# Altium schematic sheet leds.SchDoc
size A3
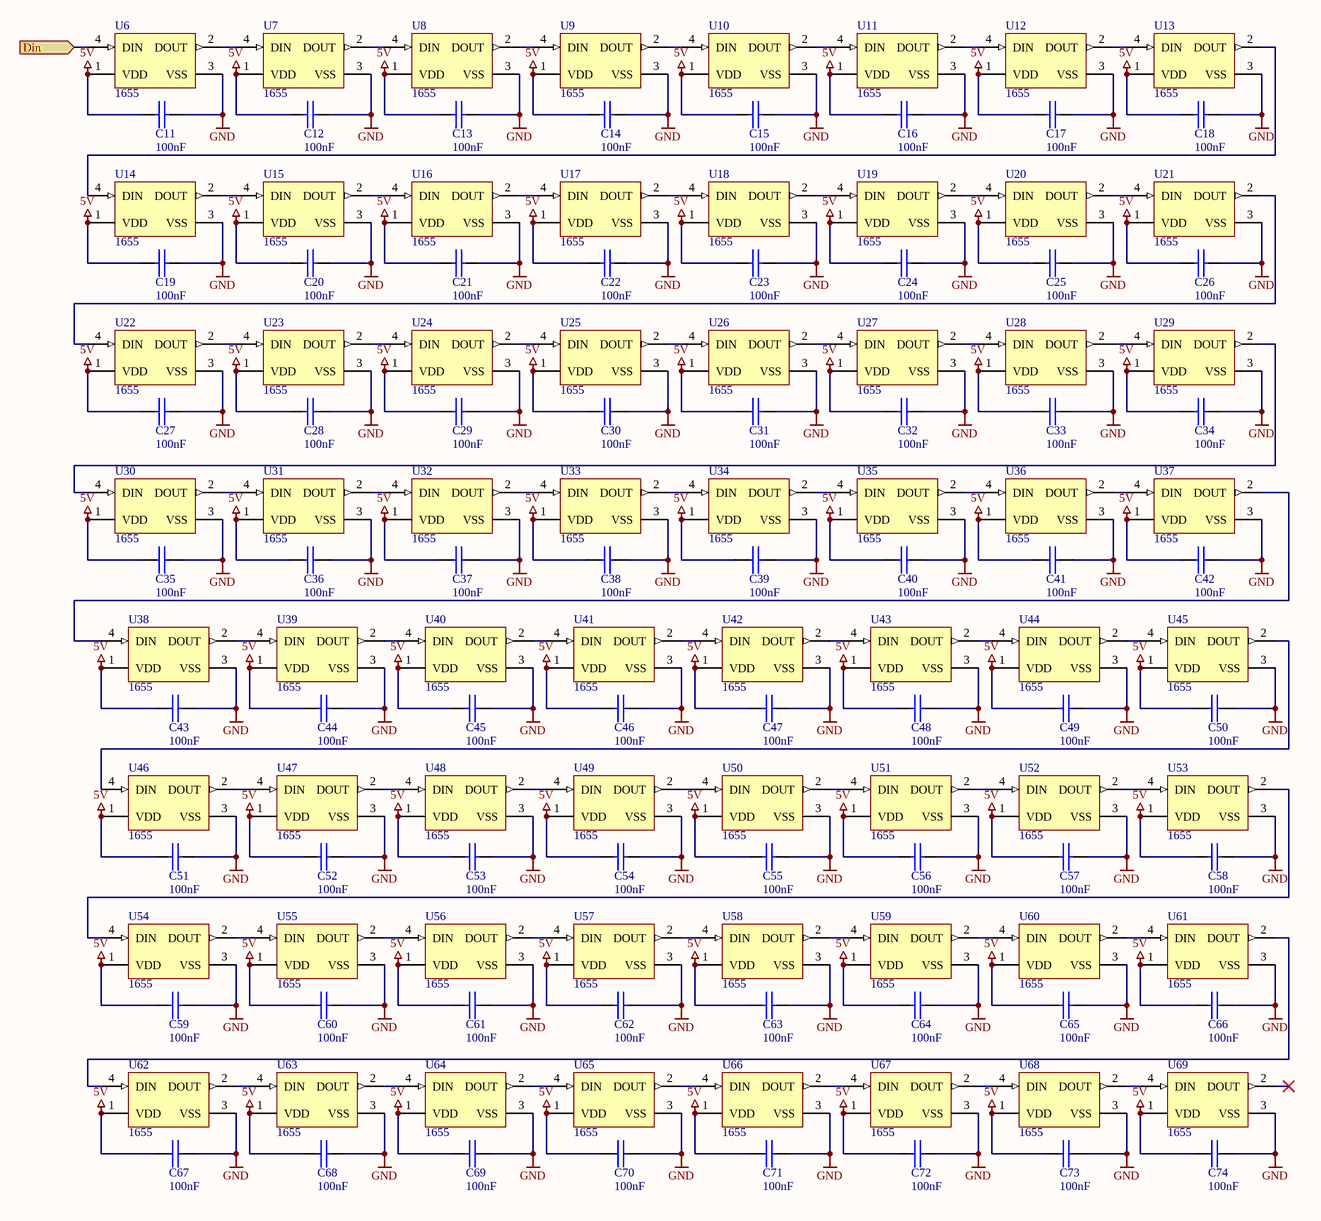
[diagram p0: leds.SchDoc]

## Parts
C11  100nF  [Cap_0805]
C12  100nF  [Cap_0805]
C13  100nF  [Cap_0805]
C14  100nF  [Cap_0805]
C15  100nF  [Cap_0805]
C16  100nF  [Cap_0805]
C17  100nF  [Cap_0805]
C18  100nF  [Cap_0805]
C19  100nF  [Cap_0805]
C20  100nF  [Cap_0805]
C21  100nF  [Cap_0805]
C22  100nF  [Cap_0805]
C23  100nF  [Cap_0805]
C24  100nF  [Cap_0805]
C25  100nF  [Cap_0805]
C26  100nF  [Cap_0805]
C27  100nF  [Cap_0805]
C28  100nF  [Cap_0805]
C29  100nF  [Cap_0805]
C30  100nF  [Cap_0805]
C31  100nF  [Cap_0805]
C32  100nF  [Cap_0805]
C33  100nF  [Cap_0805]
C34  100nF  [Cap_0805]
C35  100nF  [Cap_0805]
C36  100nF  [Cap_0805]
C37  100nF  [Cap_0805]
C38  100nF  [Cap_0805]
C39  100nF  [Cap_0805]
C40  100nF  [Cap_0805]
C41  100nF  [Cap_0805]
C42  100nF  [Cap_0805]
C43  100nF  [Cap_0805]
C44  100nF  [Cap_0805]
C45  100nF  [Cap_0805]
C46  100nF  [Cap_0805]
C47  100nF  [Cap_0805]
C48  100nF  [Cap_0805]
C49  100nF  [Cap_0805]
C50  100nF  [Cap_0805]
C51  100nF  [Cap_0805]
C52  100nF  [Cap_0805]
C53  100nF  [Cap_0805]
C54  100nF  [Cap_0805]
C55  100nF  [Cap_0805]
C56  100nF  [Cap_0805]
C57  100nF  [Cap_0805]
C58  100nF  [Cap_0805]
C59  100nF  [Cap_0805]
C60  100nF  [Cap_0805]
C61  100nF  [Cap_0805]
C62  100nF  [Cap_0805]
C63  100nF  [Cap_0805]
C64  100nF  [Cap_0805]
C65  100nF  [Cap_0805]
C66  100nF  [Cap_0805]
C67  100nF  [Cap_0805]
C68  100nF  [Cap_0805]
C69  100nF  [Cap_0805]
C70  100nF  [Cap_0805]
C71  100nF  [Cap_0805]
C72  100nF  [Cap_0805]
C73  100nF  [Cap_0805]
C74  100nF  [Cap_0805]
U6  1655  [ADA-RGB-1655_V]
U7  1655  [ADA-RGB-1655_V]
U8  1655  [ADA-RGB-1655_V]
U9  1655  [ADA-RGB-1655_V]
U10  1655  [ADA-RGB-1655_V]
U11  1655  [ADA-RGB-1655_V]
U12  1655  [ADA-RGB-1655_V]
U13  1655  [ADA-RGB-1655_V]
U14  1655  [ADA-RGB-1655_V]
U15  1655  [ADA-RGB-1655_V]
U16  1655  [ADA-RGB-1655_V]
U17  1655  [ADA-RGB-1655_V]
U18  1655  [ADA-RGB-1655_V]
U19  1655  [ADA-RGB-1655_V]
U20  1655  [ADA-RGB-1655_V]
U21  1655  [ADA-RGB-1655_V]
U22  1655  [ADA-RGB-1655_V]
U23  1655  [ADA-RGB-1655_V]
U24  1655  [ADA-RGB-1655_V]
U25  1655  [ADA-RGB-1655_V]
U26  1655  [ADA-RGB-1655_V]
U27  1655  [ADA-RGB-1655_V]
U28  1655  [ADA-RGB-1655_V]
U29  1655  [ADA-RGB-1655_V]
U30  1655  [ADA-RGB-1655_V]
U31  1655  [ADA-RGB-1655_V]
U32  1655  [ADA-RGB-1655_V]
U33  1655  [ADA-RGB-1655_V]
U34  1655  [ADA-RGB-1655_V]
U35  1655  [ADA-RGB-1655_V]
U36  1655  [ADA-RGB-1655_V]
U37  1655  [ADA-RGB-1655_V]
U38  1655  [ADA-RGB-1655_V]
U39  1655  [ADA-RGB-1655_V]
U40  1655  [ADA-RGB-1655_V]
U41  1655  [ADA-RGB-1655_V]
U42  1655  [ADA-RGB-1655_V]
U43  1655  [ADA-RGB-1655_V]
U44  1655  [ADA-RGB-1655_V]
U45  1655  [ADA-RGB-1655_V]
U46  1655  [ADA-RGB-1655_V]
U47  1655  [ADA-RGB-1655_V]
U48  1655  [ADA-RGB-1655_V]
U49  1655  [ADA-RGB-1655_V]
U50  1655  [ADA-RGB-1655_V]
U51  1655  [ADA-RGB-1655_V]
U52  1655  [ADA-RGB-1655_V]
U53  1655  [ADA-RGB-1655_V]
U54  1655  [ADA-RGB-1655_V]
U55  1655  [ADA-RGB-1655_V]
U56  1655  [ADA-RGB-1655_V]
U57  1655  [ADA-RGB-1655_V]
U58  1655  [ADA-RGB-1655_V]
U59  1655  [ADA-RGB-1655_V]
U60  1655  [ADA-RGB-1655_V]
U61  1655  [ADA-RGB-1655_V]
U62  1655  [ADA-RGB-1655_V]
U63  1655  [ADA-RGB-1655_V]
U64  1655  [ADA-RGB-1655_V]
U65  1655  [ADA-RGB-1655_V]
U66  1655  [ADA-RGB-1655_V]
U67  1655  [ADA-RGB-1655_V]
U68  1655  [ADA-RGB-1655_V]
U69  1655  [ADA-RGB-1655_V]

## Ports
Din (in)

## Nets
5V: C11.1 C12.1 C13.1 C14.1 C15.1 C16.1 C17.1 C18.1 C19.1 C20.1 C21.1 C22.1 C23.1 C24.1 C25.1 C26.1 C27.1 C28.1 C29.1 C30.1 C31.1 C32.1 C33.1 C34.1 C35.1 C36.1 C37.1 C38.1 C39.1 C40.1 C41.1 C42.1 C43.1 C44.1 C45.1 C46.1 C47.1 C48.1 C49.1 C50.1 C51.1 C52.1 C53.1 C54.1 C55.1 C56.1 C57.1 C58.1 C59.1 C60.1 C61.1 C62.1 C63.1 C64.1 C65.1 C66.1 C67.1 C68.1 C69.1 C70.1 C71.1 C72.1 C73.1 C74.1 U6.1(VDD) U7.1(VDD) U8.1(VDD) U9.1(VDD) U10.1(VDD) U11.1(VDD) U12.1(VDD) U13.1(VDD) U14.1(VDD) U15.1(VDD) U16.1(VDD) U17.1(VDD) U18.1(VDD) U19.1(VDD) U20.1(VDD) U21.1(VDD) U22.1(VDD) U23.1(VDD) U24.1(VDD) U25.1(VDD) U26.1(VDD) U27.1(VDD) U28.1(VDD) U29.1(VDD) U30.1(VDD) U31.1(VDD) U32.1(VDD) U33.1(VDD) U34.1(VDD) U35.1(VDD) U36.1(VDD) U37.1(VDD) U38.1(VDD) U39.1(VDD) U40.1(VDD) U41.1(VDD) U42.1(VDD) U43.1(VDD) U44.1(VDD) U45.1(VDD) U46.1(VDD) U47.1(VDD) U48.1(VDD) U49.1(VDD) U50.1(VDD) U51.1(VDD) U52.1(VDD) U53.1(VDD) U54.1(VDD) U55.1(VDD) U56.1(VDD) U57.1(VDD) U58.1(VDD) U59.1(VDD) U60.1(VDD) U61.1(VDD) U62.1(VDD) U63.1(VDD) U64.1(VDD) U65.1(VDD) U66.1(VDD) U67.1(VDD) U68.1(VDD) U69.1(VDD)
GND: C11.2 C12.2 C13.2 C14.2 C15.2 C16.2 C17.2 C18.2 C19.2 C20.2 C21.2 C22.2 C23.2 C24.2 C25.2 C26.2 C27.2 C28.2 C29.2 C30.2 C31.2 C32.2 C33.2 C34.2 C35.2 C36.2 C37.2 C38.2 C39.2 C40.2 C41.2 C42.2 C43.2 C44.2 C45.2 C46.2 C47.2 C48.2 C49.2 C50.2 C51.2 C52.2 C53.2 C54.2 C55.2 C56.2 C57.2 C58.2 C59.2 C60.2 C61.2 C62.2 C63.2 C64.2 C65.2 C66.2 C67.2 C68.2 C69.2 C70.2 C71.2 C72.2 C73.2 C74.2 U6.3(VSS) U7.3(VSS) U8.3(VSS) U9.3(VSS) U10.3(VSS) U11.3(VSS) U12.3(VSS) U13.3(VSS) U14.3(VSS) U15.3(VSS) U16.3(VSS) U17.3(VSS) U18.3(VSS) U19.3(VSS) U20.3(VSS) U21.3(VSS) U22.3(VSS) U23.3(VSS) U24.3(VSS) U25.3(VSS) U26.3(VSS) U27.3(VSS) U28.3(VSS) U29.3(VSS) U30.3(VSS) U31.3(VSS) U32.3(VSS) U33.3(VSS) U34.3(VSS) U35.3(VSS) U36.3(VSS) U37.3(VSS) U38.3(VSS) U39.3(VSS) U40.3(VSS) U41.3(VSS) U42.3(VSS) U43.3(VSS) U44.3(VSS) U45.3(VSS) U46.3(VSS) U47.3(VSS) U48.3(VSS) U49.3(VSS) U50.3(VSS) U51.3(VSS) U52.3(VSS) U53.3(VSS) U54.3(VSS) U55.3(VSS) U56.3(VSS) U57.3(VSS) U58.3(VSS) U59.3(VSS) U60.3(VSS) U61.3(VSS) U62.3(VSS) U63.3(VSS) U64.3(VSS) U65.3(VSS) U66.3(VSS) U67.3(VSS) U68.3(VSS) U69.3(VSS)
Din: U6.4(DIN) ; port Din
NetU6_2: U6.2(DOUT) U7.4(DIN)
NetU7_2: U7.2(DOUT) U8.4(DIN)
NetU8_2: U8.2(DOUT) U9.4(DIN)
NetU9_2: U9.2(DOUT) U10.4(DIN)
NetU10_2: U10.2(DOUT) U11.4(DIN)
NetU11_2: U11.2(DOUT) U12.4(DIN)
NetU12_2: U12.2(DOUT) U13.4(DIN)
NetU13_2: U13.2(DOUT) U14.4(DIN)
NetU14_2: U14.2(DOUT) U15.4(DIN)
NetU15_2: U15.2(DOUT) U16.4(DIN)
NetU16_2: U16.2(DOUT) U17.4(DIN)
NetU17_2: U17.2(DOUT) U18.4(DIN)
NetU18_2: U18.2(DOUT) U19.4(DIN)
NetU19_2: U19.2(DOUT) U20.4(DIN)
NetU20_2: U20.2(DOUT) U21.4(DIN)
NetU21_2: U21.2(DOUT) U22.4(DIN)
NetU22_2: U22.2(DOUT) U23.4(DIN)
NetU23_2: U23.2(DOUT) U24.4(DIN)
NetU24_2: U24.2(DOUT) U25.4(DIN)
NetU25_2: U25.2(DOUT) U26.4(DIN)
NetU26_2: U26.2(DOUT) U27.4(DIN)
NetU27_2: U27.2(DOUT) U28.4(DIN)
NetU28_2: U28.2(DOUT) U29.4(DIN)
NetU29_2: U29.2(DOUT) U30.4(DIN)
NetU30_2: U30.2(DOUT) U31.4(DIN)
NetU31_2: U31.2(DOUT) U32.4(DIN)
NetU32_2: U32.2(DOUT) U33.4(DIN)
NetU33_2: U33.2(DOUT) U34.4(DIN)
NetU34_2: U34.2(DOUT) U35.4(DIN)
NetU35_2: U35.2(DOUT) U36.4(DIN)
NetU36_2: U36.2(DOUT) U37.4(DIN)
NetU37_2: U37.2(DOUT) U38.4(DIN)
NetU38_2: U38.2(DOUT) U39.4(DIN)
NetU39_2: U39.2(DOUT) U40.4(DIN)
NetU40_2: U40.2(DOUT) U41.4(DIN)
NetU41_2: U41.2(DOUT) U42.4(DIN)
NetU42_2: U42.2(DOUT) U43.4(DIN)
NetU43_2: U43.2(DOUT) U44.4(DIN)
NetU44_2: U44.2(DOUT) U45.4(DIN)
NetU45_2: U45.2(DOUT) U46.4(DIN)
NetU46_2: U46.2(DOUT) U47.4(DIN)
NetU47_2: U47.2(DOUT) U48.4(DIN)
NetU48_2: U48.2(DOUT) U49.4(DIN)
NetU49_2: U49.2(DOUT) U50.4(DIN)
NetU50_2: U50.2(DOUT) U51.4(DIN)
NetU51_2: U51.2(DOUT) U52.4(DIN)
NetU52_2: U52.2(DOUT) U53.4(DIN)
NetU53_2: U53.2(DOUT) U54.4(DIN)
NetU54_2: U54.2(DOUT) U55.4(DIN)
NetU55_2: U55.2(DOUT) U56.4(DIN)
NetU56_2: U56.2(DOUT) U57.4(DIN)
NetU57_2: U57.2(DOUT) U58.4(DIN)
NetU58_2: U58.2(DOUT) U59.4(DIN)
NetU59_2: U59.2(DOUT) U60.4(DIN)
NetU60_2: U60.2(DOUT) U61.4(DIN)
NetU61_2: U61.2(DOUT) U62.4(DIN)
NetU62_2: U62.2(DOUT) U63.4(DIN)
NetU63_2: U63.2(DOUT) U64.4(DIN)
NetU64_2: U64.2(DOUT) U65.4(DIN)
NetU65_2: U65.2(DOUT) U66.4(DIN)
NetU66_2: U66.2(DOUT) U67.4(DIN)
NetU67_2: U67.2(DOUT) U68.4(DIN)
NetU68_2: U68.2(DOUT) U69.4(DIN)

Not connected (* = marked no-connect by the designer): U69 2(DOUT)*

## Library data of the parts
C11-C74 = C: SDTSourceLibName: C:\WINDOWS\TEMP\DA.LIB; PCB Footprint: RC0805
U6-U69 = CMP-2000-05026-1: Intelligent Control LED Integrated Light Source, 3.5 to 5.3 V, -25 to 80 degC, 4-Pin SMD, RoHS, Tape and Reel; Manufacturer: Adafruit-Industries-LLC; Number of LEDs: 10; Configuration: Discrete; Utilized LED: WS2812(5050); Datasheet URL: http://datasheet.octopart.com/ADA1655-Adafruit-Industries-datasheet-32028139.pdf; Series: Neopixel; Interface: -; Package Description: 4-Pin Surface Mount Device, Body 5 x 5 mm; Color: Red,Green,Blue(RGB); Category: Optoelectronics; Controller Type: -; Package Reference: 1655; Manufacturer URL: https://www.adafruit.com/; Mounting Type: SurfaceMount; Datasheet Version: May-13; Size / Dimension: 5.00mmLx5.00mmW; Family: Addressable,Specialty